# Altium project Smart_DCDC.PRJPCB
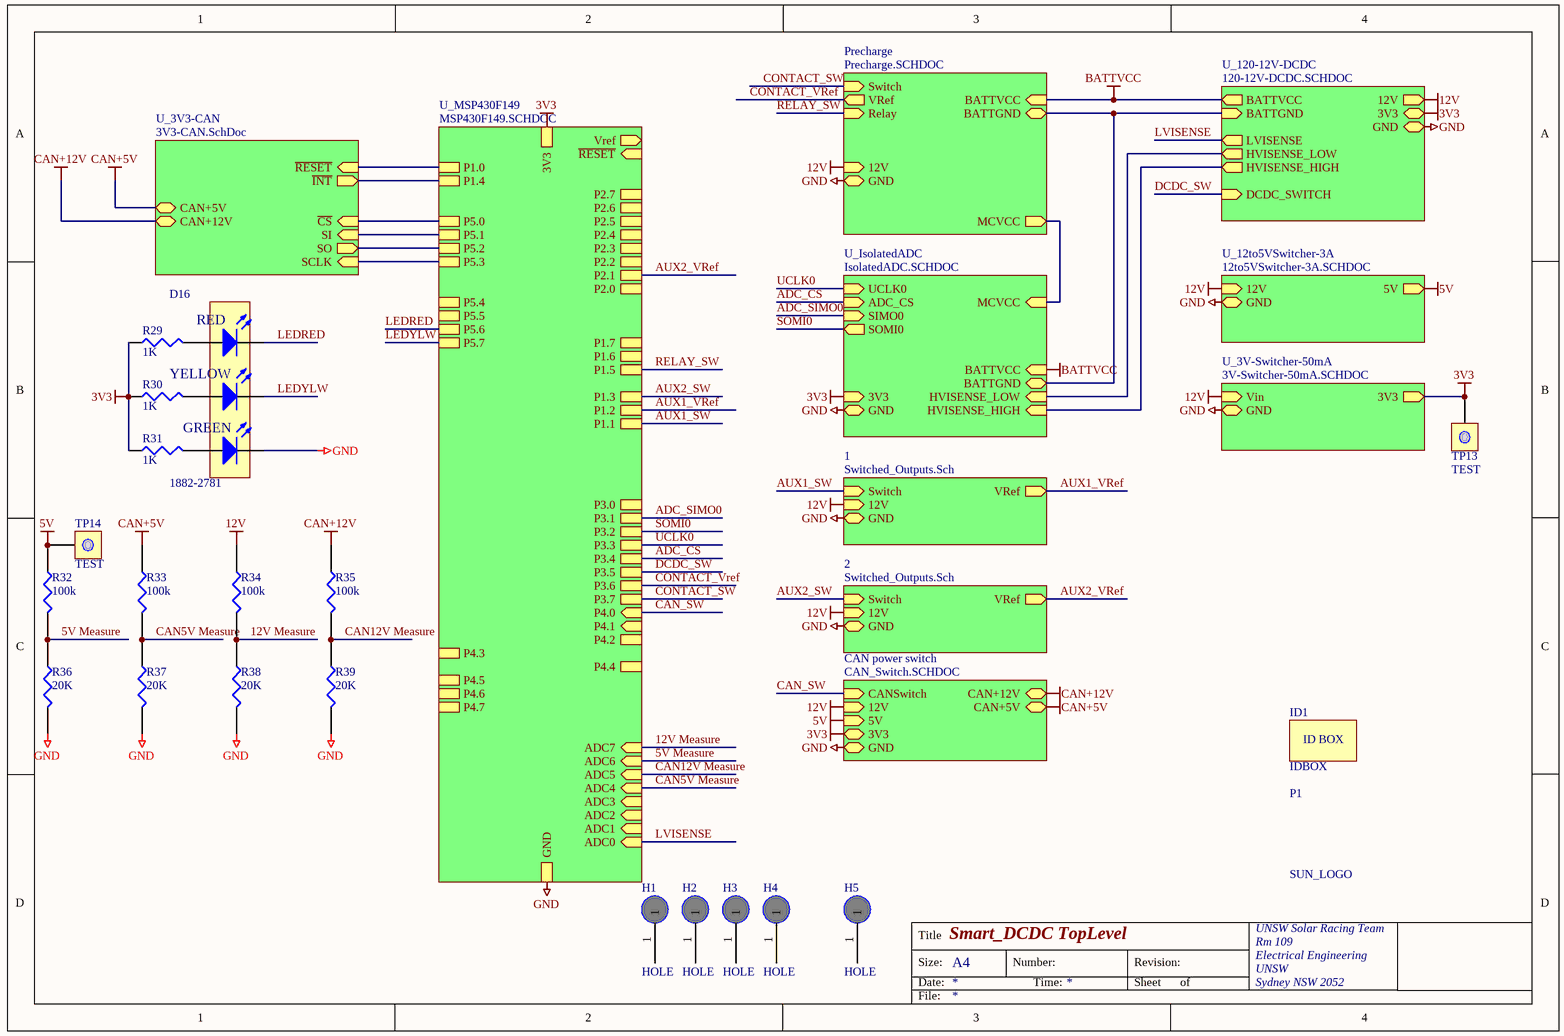
[diagram p0: TopLevel.SCHDOC]
9 sheets, 168 parts. Net scope: hierarchical (ports join the sheet entries above them; power ports are global).
Board files: Smart_DCDC_v5.PCBDOC, endpanel_highvoltage.PcbDoc, endpanel_lowvoltage.PcbDoc
Sheets:
  TopLevel.SCHDOC
    U_MSP430F149 = MSP430F149.SCHDOC
    U_120-12V-DCDC = 120-12V-DCDC.SCHDOC
    U_12to5VSwitcher-3A = 12to5VSwitcher-3A.SCHDOC
    U_3V3-CAN = 3V3-CAN.SchDoc
    U_3V-Switcher-50mA = 3V-Switcher-50mA.SCHDOC
    Precharge = Precharge.SCHDOC
    CAN power switch = CAN_Switch.SCHDOC
    U_IsolatedADC = IsolatedADC.SCHDOC

## Sheet TopLevel.SCHDOC: Smart_DCDC TopLevel
size A4; Organization: UNSW Solar Racing Team; Address3: UNSW; Address4: Sydney NSW 2052; Address2: Electrical Engineering; Address1: Rm 109

### Parts
D16  1882-2781  [LED_TRILEVEL]
H1  HOLE  [#6]
H2  HOLE  [#6]
H3  HOLE  [#6]
H4  HOLE  [#6]
H5  HOLE  [#6]
ID1  IDBOX  [IDBOX]
P1  SUN_LOGO  [SUNSWIFTLOGO]
R29  1K  [0603]
R30  1K  [0603]
R31  1K  [0603]
R32  100k  [1206]
R33  100k  [1206]
R34  100k  [1206]
R35  100k  [1206]
R36  20K  [1206]
R37  20K  [1206]
R38  20K  [1206]
R39  20K  [1206]
TP13  TEST  [TESTPOINT]
TP14  TEST  [TESTPOINT]

### Sub-sheets
1 = Switched_Outputs.Sch (file not in this document): Switch (in), VRef (out), 12V (in), GND (bidir)
2 = Switched_Outputs.Sch (file not in this document): Switch (in), VRef (out), 12V (in), GND (bidir)
CAN power switch = CAN_Switch.SCHDOC: 12V (in), CAN+12V (bidir), GND (bidir), CANSwitch (in), 5V (in), CAN+5V (bidir), 3V3
Precharge = Precharge.SCHDOC: BATTVCC (in), BATTGND (bidir), GND (bidir), 12V (in), Relay (in), Switch (in), VRef (out), MCVCC (out)
U_3V3-CAN = 3V3-CAN.SchDoc: SI (in), SO (out), ~{CS} (in), SCLK (in), ~{INT} (out), ~{RESET} (in), CAN+5V (bidir), CAN+12V (bidir)
U_3V-Switcher-50mA = 3V-Switcher-50mA.SCHDOC: GND (bidir), 3V3, Vin (in)
U_12to5VSwitcher-3A = 12to5VSwitcher-3A.SCHDOC: 12V (in), GND (bidir), 5V (out)
U_120-12V-DCDC = 120-12V-DCDC.SCHDOC: BATTVCC (out), BATTGND, 12V (out), GND (bidir), 3V3, LVISENSE (out), HVISENSE_LOW (out), HVISENSE_HIGH (out), DCDC_SWITCH (in)
U_IsolatedADC = IsolatedADC.SCHDOC: UCLK0 (in), ADC_CS (in), SIMO0 (in), SOMI0 (out), BATTGND, GND (bidir), BATTVCC (in), MCVCC (in), HVISENSE_LOW (in), HVISENSE_HIGH (in), 3V3 (in)
U_MSP430F149 = MSP430F149.SCHDOC: GND, 3V3, ADC0 (in), ADC1 (in), ADC2 (in), ADC3 (in), ADC4 (in), ADC5 (in), ADC6 (in), ADC7 (in), P1.0, P1.1, P1.2, P1.3, P1.4, P1.5, P1.6, P1.7, P2.0, P2.1, P2.2, P2.3, P2.4, P2.5, P2.6, P2.7, P3.0, P3.1, P3.2, P3.3, P3.4, Vref (out), ~{RESET} (in), P3.5, P3.6, P3.7, P4.0 (in), P4.1 (in), P4.2, P4.3, P4.4, P4.5, P4.6, P4.7, P5.0, P5.1, P5.2, P5.3, P5.4, P5.5, P5.6, P5.7

### Nets
3V3: R29.1 R30.1 R31.1 TP13.0(TP) ; sheet U_MSP430F149/3V3, sheet U_120-12V-DCDC/3V3, sheet U_3V-Switcher-50mA/3V3, sheet CAN power switch/3V3, sheet U_IsolatedADC/3V3
5V: R32.1 TP14.0(TP) ; sheet U_12to5VSwitcher-3A/5V, sheet CAN power switch/5V
12V: R34.1 ; sheet U_120-12V-DCDC/12V, sheet U_12to5VSwitcher-3A/12V, sheet U_3V-Switcher-50mA/Vin, sheet 1/12V, sheet 2/12V, sheet Precharge/12V, sheet CAN power switch/12V
BATTGND: sheet U_120-12V-DCDC/BATTGND, sheet Precharge/BATTGND, sheet U_IsolatedADC/BATTGND
BATTVCC: sheet U_120-12V-DCDC/BATTVCC, sheet Precharge/BATTVCC, sheet U_IsolatedADC/BATTVCC
CAN+5V: R33.1 ; sheet U_3V3-CAN/CAN+5V, sheet CAN power switch/CAN+5V
CAN+12V: R35.1 ; sheet U_3V3-CAN/CAN+12V, sheet CAN power switch/CAN+12V
GND: D16.1(K) R36.2 R37.2 R38.2 R39.2 ; sheet U_MSP430F149/GND, sheet U_120-12V-DCDC/GND, sheet U_12to5VSwitcher-3A/GND, sheet U_3V-Switcher-50mA/GND, sheet 1/GND, sheet 2/GND, sheet Precharge/GND, sheet CAN power switch/GND, sheet U_IsolatedADC/GND
5V Measure: R32.2 R36.1 ; sheet U_MSP430F149/ADC6
12V Measure: R34.2 R38.1 ; sheet U_MSP430F149/ADC7
ADC_CS: sheet U_MSP430F149/P3.4, sheet U_IsolatedADC/ADC_CS
ADC_SIMO0: sheet U_MSP430F149/P3.1, sheet U_IsolatedADC/SIMO0
AUX1_SW: sheet U_MSP430F149/P1.1, sheet 1/Switch
AUX1_VRef: sheet U_MSP430F149/P1.2, sheet 1/VRef
AUX2_SW: sheet U_MSP430F149/P1.3, sheet 2/Switch
AUX2_VRef: sheet U_MSP430F149/P2.1, sheet 2/VRef
CAN5V Measure: R33.2 R37.1 ; sheet U_MSP430F149/ADC4  [project net ADC4]
CAN12V Measure: R35.2 R39.1 ; sheet U_MSP430F149/ADC5  [project net ADC5]
CAN_SW: sheet U_MSP430F149/P4.0, sheet CAN power switch/CANSwitch
CONTACT_SW: sheet U_MSP430F149/P3.7, sheet Precharge/Switch
CONTACT_Vref: sheet U_MSP430F149/P3.6, sheet Precharge/VRef
DCDC_SW: sheet U_MSP430F149/P3.5, sheet U_120-12V-DCDC/DCDC_SWITCH
LEDRED: D16.3(K) ; sheet U_MSP430F149/P5.6
LEDYLW: D16.2(K) ; sheet U_MSP430F149/P5.7
LVISENSE: sheet U_MSP430F149/ADC0, sheet U_120-12V-DCDC/LVISENSE  [project net ADC0]
MCVCC: sheet Precharge/MCVCC, sheet U_IsolatedADC/MCVCC
P1.0: sheet U_MSP430F149/P1.0, sheet U_3V3-CAN/~{RESET}
P1.4: sheet U_MSP430F149/P1.4, sheet U_3V3-CAN/~{INT}
P5.0: sheet U_MSP430F149/P5.0, sheet U_3V3-CAN/~{CS}
P5.1: sheet U_MSP430F149/P5.1, sheet U_3V3-CAN/SI
P5.2: sheet U_MSP430F149/P5.2, sheet U_3V3-CAN/SO
P5.3: sheet U_MSP430F149/P5.3, sheet U_3V3-CAN/SCLK
RELAY_SW: sheet U_MSP430F149/P1.5, sheet Precharge/Relay  [project net P1.5]
SOMI0: sheet U_MSP430F149/P3.2, sheet U_IsolatedADC/SOMI0  [project net P3.2]
UCLK0: sheet U_MSP430F149/P3.3, sheet U_IsolatedADC/UCLK0  [project net P3.3]
NetC22_1: sheet U_120-12V-DCDC/HVISENSE_HIGH, sheet U_IsolatedADC/HVISENSE_HIGH
NetC22_2: sheet U_120-12V-DCDC/HVISENSE_LOW, sheet U_IsolatedADC/HVISENSE_LOW
NetD16_4: D16.4(A) R29.2
NetD16_5: D16.5(A) R30.2
NetD16_6: D16.6(A) R31.2

Not connected (* = marked no-connect by the designer): H1 1; H2 1; H3 1; H4 1; H5 1

### Notes on the sheet
- Title
- Size:
- Date:
- A4
- Number:
- Time:
- Revision:
- Sheet
- of
- File:
- (in symbol IDBOX) ID BOX
- (in symbol LED-TRILEVEL) RED; YELLOW; GREEN

### Library data of the parts
D16 = LED-TRILEVEL: Three level LED; Farnell: 1461596
H1-H5 = HOLE: Order#: NA; Supplier: NA; Price: NA
R29-R31 = RES1: Resistor; Order#: 9331697; Supplier: Farnell; Price: 0.05
R32-R39 = RES1: Price: 1.16; Digikey: -
  R32-R35: Farnell: 308-6422
  R36-R39: Farnell: 308-6252
TP13 TP14 = TEST: TEST POINT

## Sheet MSP430F149.SCHDOC
size A4; Organization: UNSW Solar Racing Team; Address3: UNSW; Address4: Sydney NSW 2052; Address2: Electrical Engineering; Address1: Rm 109
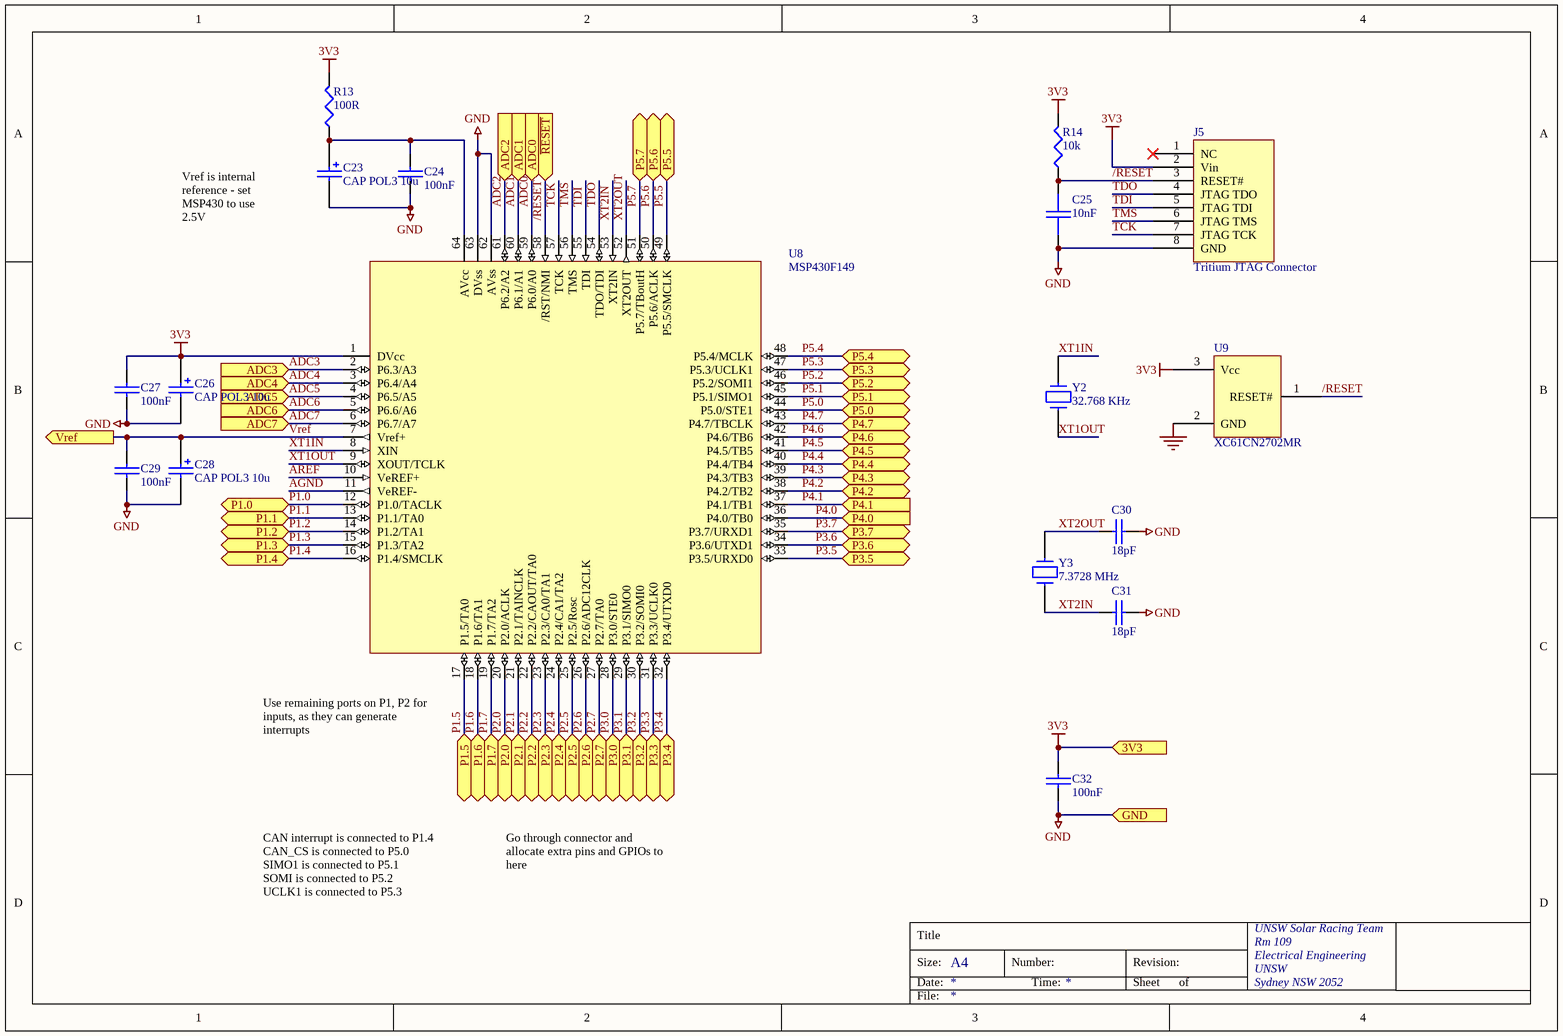
[diagram p1: MSP430F149.SCHDOC]

### Parts
C23  CAP POL3 10u  [MCCT-CASEA]
C24  100nF  [0603]
C25  10nF  [0603]
C26  CAP POL3 10u  [MCCT-CASEA]
C27  100nF  [0603]
C28  CAP POL3 10u  [MCCT-CASEA]
C29  100nF  [0603]
C30  18pF  [0603]
C31  18pF  [0603]
C32  100nF  [0603]
J5  Tritium JTAG Connector  [HDR2X5]
R13  100R  [0603]
R14  10k  [0603]
U8  MSP430F149  [QFP64]
U9  XC61CN2702MR  [SOT23-3]
Y2  32.768 KHz  [WATCHA]
Y3  7.3728 MHz  [HC49/4H]

### Ports
3V3, ADC0 (in), ADC1 (in), ADC2 (in), ADC3 (in), ADC4 (in), ADC5 (in), ADC6 (in), ADC7 (in), GND, P1.0, P1.1, P1.2, P1.3, P1.4, P1.5, P1.6, P1.7, P2.0, P2.1, P2.2, P2.3, P2.4, P2.5, P2.6, P2.7, P3.0, P3.1, P3.2, P3.3, P3.4, P3.5, P3.6, P3.7, P4.0 (in), P4.1 (in), P4.2, P4.3, P4.4, P4.5, P4.6, P4.7, P5.0, P5.1, P5.2, P5.3, P5.4, P5.5, P5.6, P5.7, Vref (out), ~{RESET} (in)

### Nets
3V3: C26.1 C27.1 C32.1 J5.2(Vin) R13.2 R14.2 U8.1(DVcc) U9.3(Vcc) ; port 3V3
GND: C23.2 C24.2 C25.2 C26.2 C27.2 C28.2 C29.2 C30.2 C31.2 C32.2 J5.8(GND) U8.62(AVss) U8.63(DVss) U9.2(GND) ; port GND
/RESET: C25.1 J5.3(RESET#) R14.1 U8.58(/RST/NMI) U9.1(RESET#) ; port ~{RESET}
ADC0: U8.59(P6.0/A0) ; port ADC0
ADC1: U8.60(P6.1/A1) ; port ADC1
ADC2: U8.61(P6.2/A2) ; port ADC2
ADC3: U8.2(P6.3/A3) ; port ADC3
ADC4: U8.3(P6.4/A4) ; port ADC4
ADC5: U8.4(P6.5/A5) ; port ADC5
ADC6: U8.5(P6.6/A6) ; port ADC6  [project net 5V Measure]
ADC7: U8.6(P6.7/A7) ; port ADC7  [project net 12V Measure]
AGND: U8.11(VeREF-)
AREF: U8.10(VeREF+)
P1.0: U8.12(P1.0/TACLK) ; port P1.0
P1.1: U8.13(P1.1/TA0) ; port P1.1  [project net AUX1_SW]
P1.2: U8.14(P1.2/TA1) ; port P1.2  [project net AUX1_VRef]
P1.3: U8.15(P1.3/TA2) ; port P1.3  [project net AUX2_SW]
P1.4: U8.16(P1.4/SMCLK) ; port P1.4
P1.5: U8.17(P1.5/TA0) ; port P1.5
P1.6: U8.18(P1.6/TA1) ; port P1.6
P1.7: U8.19(P1.7/TA2) ; port P1.7
P2.0: U8.20(P2.0/ACLK) ; port P2.0
P2.1: U8.21(P2.1/TAINCLK) ; port P2.1  [project net AUX2_VRef]
P2.2: U8.22(P2.2/CAOUT/TA0) ; port P2.2
P2.3: U8.23(P2.3/CA0/TA1) ; port P2.3
P2.4: U8.24(P2.4/CA1/TA2) ; port P2.4
P2.5: U8.25(P2.5/Rosc) ; port P2.5
P2.6: U8.26(P2.6/ADC12CLK) ; port P2.6
P2.7: U8.27(P2.7/TA0) ; port P2.7
P3.0: U8.28(P3.0/STE0) ; port P3.0
P3.1: U8.29(P3.1/SIMO0) ; port P3.1  [project net ADC_SIMO0]
P3.2: U8.30(P3.2/SOMI0) ; port P3.2
P3.3: U8.31(P3.3/UCLK0) ; port P3.3
P3.4: U8.32(P3.4/UTXD0) ; port P3.4  [project net ADC_CS]
P3.5: U8.33(P3.5/URXD0) ; port P3.5  [project net DCDC_SW]
P3.6: U8.34(P3.6/UTXD1) ; port P3.6  [project net CONTACT_Vref]
P3.7: U8.35(P3.7/URXD1) ; port P3.7  [project net CONTACT_SW]
P4.0: U8.36(P4.0/TB0) ; port P4.0  [project net CAN_SW]
P4.1: U8.37(P4.1/TB1) ; port P4.1
P4.2: U8.38(P4.2/TB2) ; port P4.2
P4.3: U8.39(P4.3/TB3) ; port P4.3
P4.4: U8.40(P4.4/TB4) ; port P4.4
P4.5: U8.41(P4.5/TB5) ; port P4.5
P4.6: U8.42(P4.6/TB6) ; port P4.6
P4.7: U8.43(P4.7/TBCLK) ; port P4.7
P5.0: U8.44(P5.0/STE1) ; port P5.0
P5.1: U8.45(P5.1/SIMO1) ; port P5.1
P5.2: U8.46(P5.2/SOMI1) ; port P5.2
P5.3: U8.47(P5.3/UCLK1) ; port P5.3
P5.4: U8.48(P5.4/MCLK) ; port P5.4
P5.5: U8.49(P5.5/SMCLK) ; port P5.5
P5.6: U8.50(P5.6/ACLK) ; port P5.6  [project net LEDRED]
P5.7: U8.51(P5.7/TBoutH) ; port P5.7  [project net LEDYLW]
TCK: J5.7(JTAG_TCK) U8.57(TCK)
TDI: J5.5(JTAG_TDI) U8.55(TDI)
TDO: J5.4(JTAG_TDO) U8.54(TDO/TDI)
TMS: J5.6(JTAG_TMS) U8.56(TMS)
Vref: C28.1 C29.1 U8.7(Vref+) ; port Vref
XT1IN: U8.8(XIN) Y2.2
XT1OUT: U8.9(XOUT/TCLK) Y2.1
XT2IN: C31.1 U8.53(XT2IN) Y3.1
XT2OUT: C30.1 U8.52(XT2OUT) Y3.2
NetC23_1: C23.1 C24.1 R13.1 U8.64(AVcc)

Not connected (* = marked no-connect by the designer): J5 1(NC)*

### Notes on the sheet
- Vref is internal reference - set MSP430 to use 2.5V
- (near U8) Use remaining ports on P1, P2 for inputs, as they can generate interrupts
- CAN interrupt is connected to P1.4
  CAN_CS is connected to P5.0
  SIMO1 is connected to P5.1
  SOMI is connected to P5.2
  UCLK1 is connected to P5.3
- Go through connector and allocate extra pins and GPIOs to here
- Title
- Size:
- Date:
- A4
- Number:
- Time:
- Revision:
- Sheet
- of
- File:

### Library data of the parts
C23 C26 C28 = CAP POL3: Polarized Capacitor (Surface Mount); Revision: July-2002: Re-released for DXP Platform.; Digikey: 478-3121-1-ND; DigikeyPrice: 0.41; Farnell: 1432264; FarnellPrice: 0.30
C24 C25 C27 C29-C32 = CAP: Capacitor
  C24 C27 C29 C32: Farnell: 753-567; Price: 0.30
  C25: Farnell: 722-236; Price: 0.11
  C30 C31: Farnell: 721-992; Price: 0.10
J5 = 430F_JTAG_TRITIUM: Tritium JTAG interface for MSP430; Extra parts: 672-520, 672-555; Farnell: 1022233; Price: 2.19
R13 R14 = RES1: Resistor; Price: 0.11
  R13: Farnell: 612-364
  R14: Farnell: 612-601
U8 = MSP430F14X: Farnell: NA
U9 = XC61F: SOT23 reset generator; Farnell: 3605449; FarnellPrice: 1.42; Digikey: -
Y2 Y3 = CRYSTAL
  Y2: Farnell: 9509682; FarnellPrice: 2.14; Digikey: 300-8301-ND; DigikeyPrice: 0.28
  Y3: Farnell: 7940385; FarnellPrice: 0.835; Digikey: X1056-ND; DigikeyPrice: 0.58

## Sheet 120-12V-DCDC.SCHDOC: 120V - 12/15V DCDC Converter
size A4; Organization: UNSW Solar Racing Team; Address3: UNSW; Address4: Sydney NSW 2052; SheetNumber: 2; SheetTotal: 4; Address2: Electrical Engineering; Address1: Rm 109
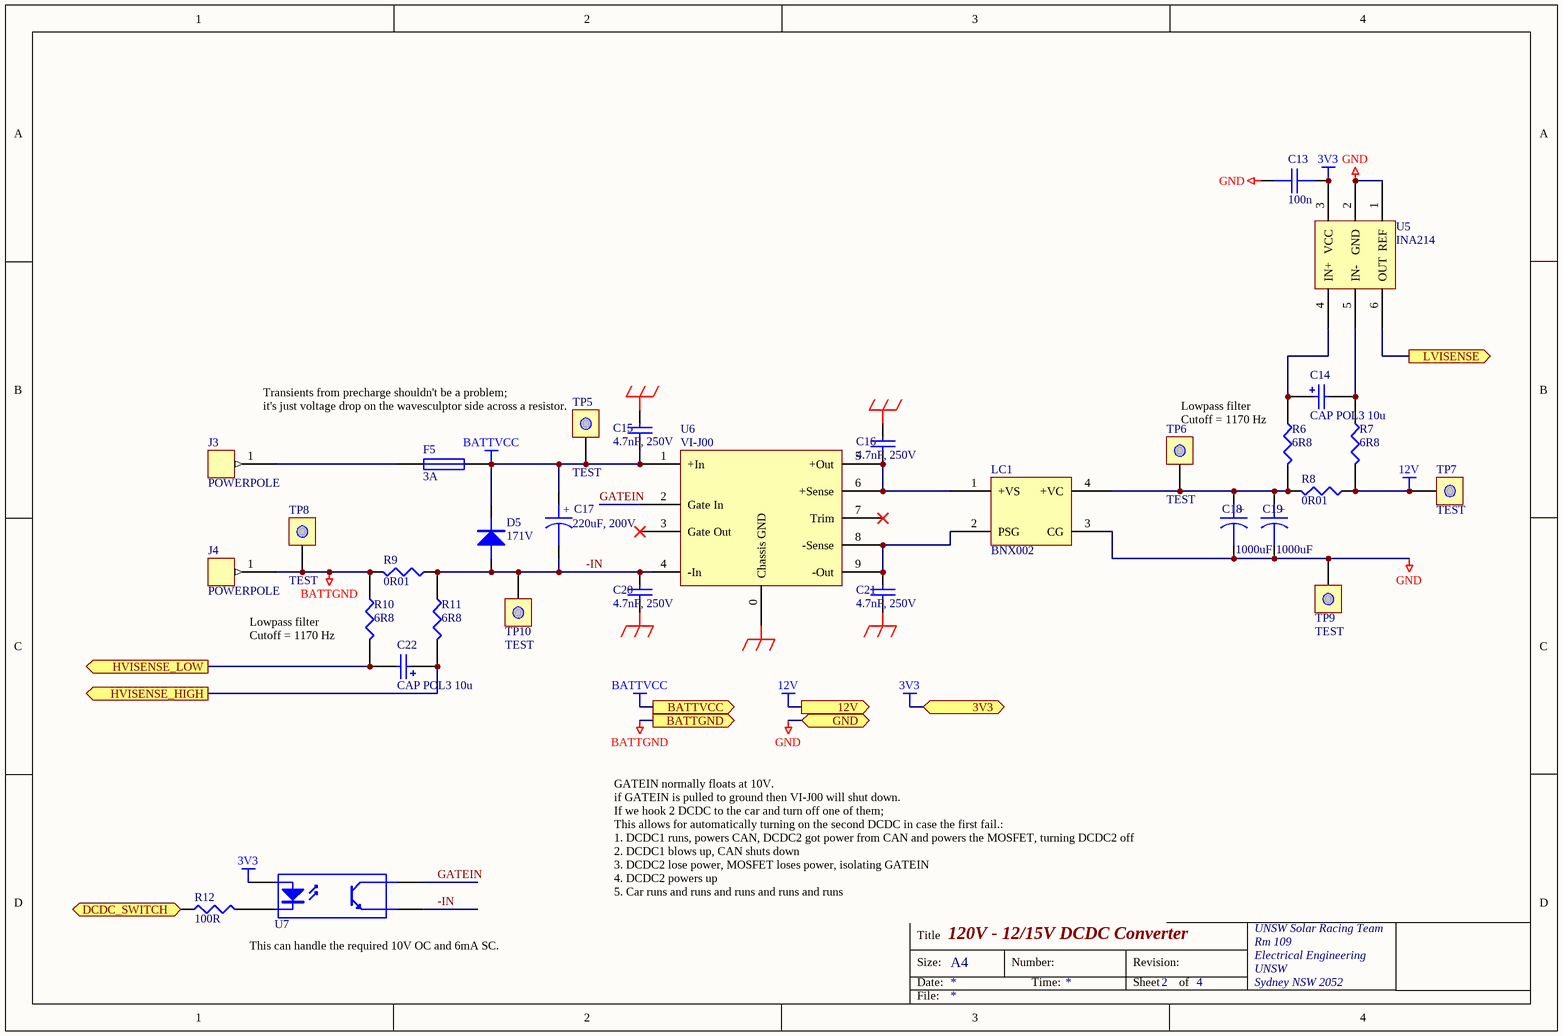
[diagram p2: 120-12V-DCDC.SCHDOC]

### Parts
C13  100n  [0603]
C14  CAP POL3 10u  [MCCT-CASEA]
C15  4.7nF, 250V  [POLYESTER-5]
C16  4.7nF, 250V  [POLYESTER-5]
C17  220uF, 200V  [ELECTROLYTIC-10-20]
C18  1000uF  [ELECTROLYTIC-5-10]
C19  1000uF  [ELECTROLYTIC-5-10]
C20  4.7nF, 250V  [POLYESTER-5]
C21  4.7nF, 250V  [POLYESTER-5]
C22  CAP POL3 10u  [MCCT-CASEA]
D5  171V  [DIODE-D1.2mm]
F5  3A  [FUSE-BAYONET-RA]
J3  POWERPOLE  [POWERPOLE25A]
J4  POWERPOLE  [POWERPOLE25A]
LC1  BNX002  [BNX002]
R6  6R8  [0603]
R7  6R8  [0603]
R8  0R01  [CRA2512]
R9  0R01  [CRA2512]
R10  6R8  [0603]
R11  6R8  [0603]
R12  100R  [0603]
TP5  TEST  [TESTPOINT]
TP6  TEST  [TESTPOINT]
TP7  TEST  [TESTPOINT]
TP8  TEST  [TESTPOINT]
TP9  TEST  [TESTPOINT]
TP10  TEST  [TESTPOINT]
U5  INA214  [SC70-6]
U6  VI-J00  [VI-J00]
U7  PC3H7J00000F  [PC3H7]  (value not drawn)

### Ports
3V3, 12V (out), BATTGND, BATTVCC (out), DCDC_SWITCH (in), GND (bidir), HVISENSE_HIGH (out), HVISENSE_LOW (out), LVISENSE (out)

### Nets
3V3: C13.2 U5.3(VCC) U7.1(A) ; port 3V3
12V: R7.2 R8.1 TP7.0(TP) ; port 12V
BATTGND: J4.1 R9.2 R10.1 TP8.0(TP) ; port BATTGND
BATTVCC: C15.1 C17.1 D5.K F5.1 TP5.0(TP) U6.1(+In) ; port BATTVCC
CGND: C15.2 C16.2 C20.1 C21.1 U6.0(Chassis_GND)
GND: C13.1 C18.2 C19.2 LC1.3(CG) TP9.0(TP) U5.1(REF) U5.2(GND) ; port GND
-IN: C17.2 C20.2 D5.A R9.1 R11.1 TP10.0(TP) U6.4(-In) U7.3(E)
ADC0: U5.6(OUT) ; port LVISENSE
DCDC_SW: R12.1 ; port DCDC_SWITCH
GATEIN: U6.2(Gate_In) U7.4(C)
NetC14_1: C14.1 R6.1 U5.4(IN+)
NetC14_2: C14.2 R7.1 U5.5(IN-)
NetC16_1: C16.1 LC1.1(+VS) U6.5(+Out) U6.6(+Sense)
NetC18_1: C18.1 C19.1 LC1.4(+VC) R6.2 R8.2 TP6.0(TP)
NetC21_2: C21.2 LC1.2(PSG) U6.8(-Sense) U6.9(-Out)
NetC22_1: C22.1 R11.2 ; port HVISENSE_HIGH
NetC22_2: C22.2 R10.2 ; port HVISENSE_LOW
NetF5_2: F5.2 J3.1
NetR12_2: R12.2 U7.2(K)

Not connected (* = marked no-connect by the designer): U6 3(Gate_Out)* 7(Trim)*

### Notes on the sheet
- (near TP5) Transients from precharge shouldn't be a problem;
  it's just voltage drop on the wavesculptor side across a resistor.
- Lowpass filter
  Cutoff = 1170 Hz
- (near R10) Lowpass filter
  Cutoff = 1170 Hz
- GATEIN normally floats at 10V.
  if GATEIN is pulled to ground then VI-J00 will shut down.
  If we hook 2 DCDC to the car and turn off one of them;
  This allows for automatically turning on the second DCDC in case the first fail.:
  1. DCDC1 runs, powers CAN, DCDC2 got power from CAN and powers the MOSFET, turning DCDC2 off
  2. DCDC1 blows up, CAN shuts down
  3. DCDC2 lose power, MOSFET loses power, isolating GATEIN
  4. DCDC2 powers up
  5. Car runs and runs and runs and runs and runs
- This can handle the required 10V OC and 6mA SC.
- Title
- Size:
- Date:
- A4
- Number:
- Time:
- Revision:
- Sheet
- of
- File:
- (in symbol CAPACITOR POL) +

### Library data of the parts
C13 C15 C16 C20 C21 = CAP: Capacitor
  C13: Price: 0.30
  C15 C16 C20 C21: Price: 0.18; Farnell: 1166076; Digikey: 3005PH-ND; DigikeyPrice: 0.124
C14 C22 = CAP POL3: Polarized Capacitor (Surface Mount); Revision: July-2002: Re-released for DXP Platform.; Digikey: 478-3121-1-ND; DigikeyPrice: 0.41; Farnell: 1432264; FarnellPrice: 0.30
C17-C19 = CAPACITOR POL: Capacitor
  C17: FarnellPrice: 2.91; Farnell: 1040995; Digikey: 493-2504-ND; DigikeyPrice: 2.05
  C18 C19: Price: 1.36; Farnell: 9451226
D5 = DIODE: Order#: 1017610; Supplier: Farnell; Price: ?
F5 = FUSE1: Fuse; Price: 5.43; Farnell: 149-920; Digikey: -
J3 = CON1: RS: 534-985 + 534-963; Farnell: -; Digikey: -
J4 = CON1: RS: 534-979 + 534-963; Farnell: -; Digikey: -
LC1 = BNX002: 10A Switchmode Supply Output Filter; Farnell: 9526943; FarnellPrice: 15.0; Digikey: BNX002-01; DigikeyPrice: 11.90
R6 R7 R10 R11 = RES1
R8 R9 = CRA2512: Current Sense Resistor; Farnell: 1435947; Price: 0.736
  R9: Digikey: CRA2512-FZ-R010ELFCT-ND; DigikeyPrice: 0.49
R12 = RES1: Resistor
TP5-TP10 = TEST: TEST POINT
U5 = INA214: Current Sensor; Farnell: 1606447; Digikey: 296-23422-1-ND
U6 = VI-J00: VI-J00 Switch Mode DC-DC Converter
U7 = PC3H7J00000F: Opto-coupler; Farnell: 9707603; FarnellPrice: 0.6; Digikey: 425-2116-1-ND; DigikeyPrice: 0.45

## Sheet 12to5VSwitcher-3A.SCHDOC
size A4; Organization: UNSW Solar Racing Team; Address3: UNSW; Address4: Sydney NSW 2052; Address2: Electrical Engineering; Address1: Rm 109
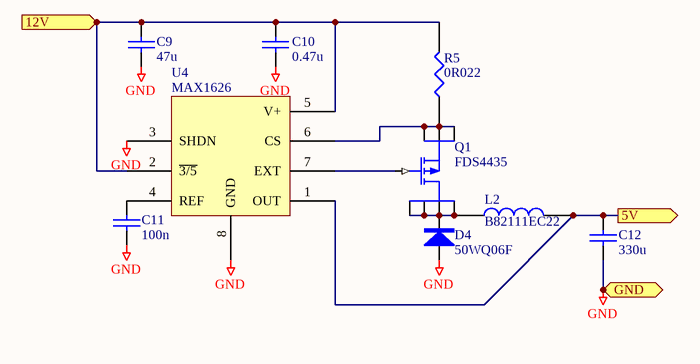
[diagram p3: 12to5VSwitcher-3A.SCHDOC]

### Parts
C9  47u  [KEMET_CASED]
C10  0.47u  [1206]
C11  100n  [0603]
C12  330u  [KEMET_CASED]
D4  50WQ06F  [DPAK]
L2  B82111EC22  [PCH-45]
Q1  FDS4435  [SO8]
R5  0R022  [2512]
U4  MAX1626  [SO8]

### Ports
5V (out), 12V (in), GND (bidir)

### Nets
5V: C12.1 L2.2 U4.1(OUT) ; port 5V
12V: C9.1 C10.1 R5.2 U4.2(~{3/5}) U4.5(V+) ; port 12V
GND: C9.2 C10.2 C11.2 C12.2 D4.1(A) U4.3(SHDN) U4.8(GND) ; port GND
NetC11_1: C11.1 U4.4(REF)
NetD4_2: D4.2(K) L2.1 Q1.5(D) Q1.6(D) Q1.7(D) Q1.8(D)
NetQ1_1: Q1.1(S) Q1.2(S) Q1.3(S) R5.1 U4.6(CS)
NetQ1_4: Q1.4(G) U4.7(EXT)

### Notes on the sheet
- Title
- Size:
- Date:
- A4
- Number:
- Time:
- Revision:
- Sheet
- of
- File:

### Library data of the parts
C9-C12 = CAP: Capacitor
  C9: Farnell: 1601655; Price: 1.29; Digikey: 495-1544-1-ND; DigikeyPrice: 0.87
  C10: FarnellPrice: 0.668; OldFarnell: 757-688; Farnell: 4900388
  C11: Farnell: have; Price: 0
  C12: Farnell: 1183405; FarnellPrice: 2.60; Digikey: 399-3884-1-ND; DigikeyPrice: 2.1
D4 = 50WQ06F: Diode; Farnell: 9101314; Price: 2.99
L2 = INDUCTOR: Digikey: 608671; DigikeyPrice: 1.24
Q1 = SI4425DY: FDS4435P Channel Mosfet; Farnell: 9846204; Price: 2.99; Digikey: FDS4435BZCT-ND; DigikeyPrice: 0.8
R5 = RES1: DigikeyPrice: 2.805; Digikey: RL32T.022GCT-ND
U4 = MAX1626: Farnell: 9725342; FarnellPrice: 9.09; Digikey: MAX1626ESA+-ND; DigikeyPrice: 4.61

## Sheet 3V3-CAN.SchDoc
size A4; Organization: UNSW Solar Racing Team; Address3: UNSW; Address4: Sydney NSW 2052; Address2: Electrical Engineering; Address1: Rm 109
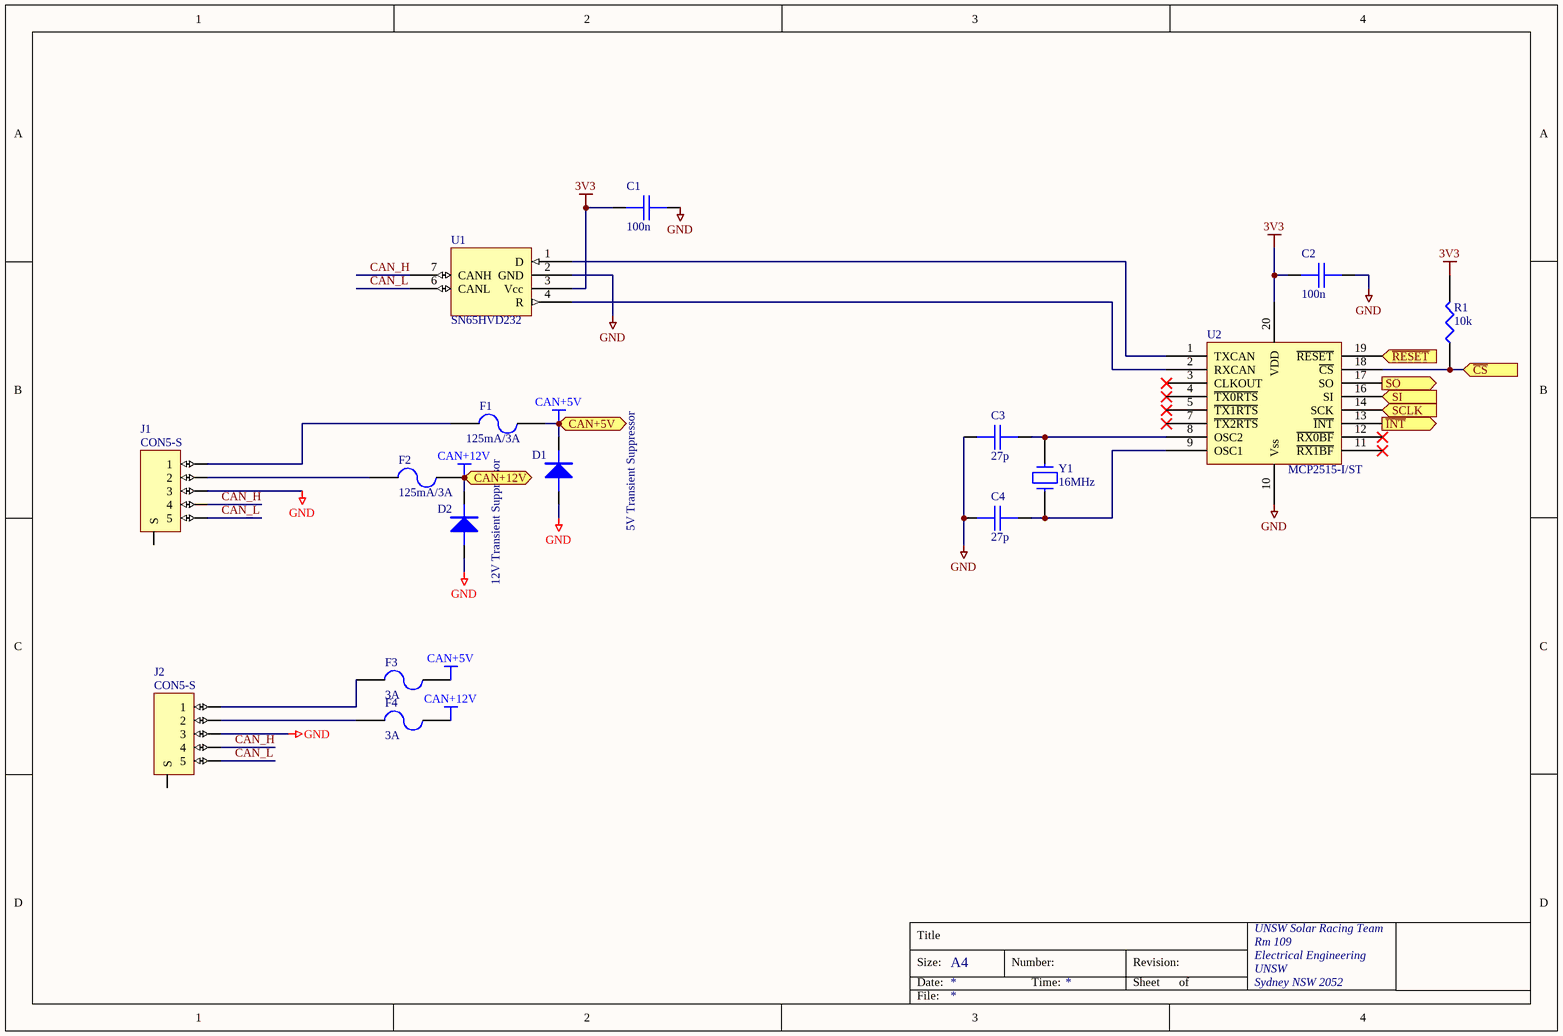
[diagram p4: 3V3-CAN.SchDoc]

### Parts
C1  100n  [0603]
C2  100n  [0603]
C3  27p  [0603]
C4  27p  [0603]
D1  5V Transient Suppressor  [SMA]
D2  12V Transient Suppressor  [SMA]
F1  125mA/3A  [LITTELFUSE-154]
F2  125mA/3A  [LITTELFUSE-154]
F3  3A  [LITTELFUSE-154]
F4  3A  [LITTELFUSE-154]
J1  CON5-S  [TRIAD5F]
J2  CON5-S  [TRIAD5F]
R1  10k  [0603]
U1  SN65HVD232  [SO8]
U2  MCP2515-I/ST  [TSSOP20]
Y1  16MHz  [HC49/4H]

### Ports
CAN+5V (bidir), CAN+12V (bidir), SCLK (in), SI (in), SO (out), ~{CS} (in), ~{INT} (out), ~{RESET} (in)

### Nets
3V3: C1.2 C2.1 R1.2 U1.3(Vcc) U2.20(VDD)
CAN+5V: D1.K F1.2 F3.2 ; port CAN+5V
CAN+12V: D2.K F2.2 F4.2 ; port CAN+12V
GND: C1.1 C2.2 C3.1 C4.1 D1.A D2.A J1.3 J2.3 U1.2(GND) U2.10(Vss)
CAN_H: J1.4 J2.4 U1.7(CANH)
CAN_L: J1.5 J2.5 U1.6(CANL)
P1.0: U2.19(~{RESET}) ; port ~{RESET}
P1.4: U2.13(~{INT}) ; port ~{INT}
P5.0: R1.1 U2.18(~{CS}) ; port ~{CS}
P5.1: U2.16(SI) ; port SI
P5.2: U2.17(SO) ; port SO
P5.3: U2.14(SCK) ; port SCLK
NetC3_2: C3.2 U2.8(OSC2) Y1.1
NetC4_2: C4.2 U2.9(OSC1) Y1.2
NetF1_1: F1.1 J1.1
NetF2_1: F2.1 J1.2
NetF3_1: F3.1 J2.1
NetF4_1: F4.1 J2.2
NetU1_1: U1.1(D) U2.1(TXCAN)
NetU1_4: U1.4(R) U2.2(RXCAN)

Not connected (* = marked no-connect by the designer): J1 0(S); J2 0(S); U2 3(CLKOUT)* 4(~{TX0RTS})* 5(~{TX1RTS})* 7(~{TX2RTS})* 11(~{RX1BF})* 12(~{RX0BF})*

### Notes on the sheet
- Title
- Size:
- Date:
- A4
- Number:
- Time:
- Revision:
- Sheet
- of
- File:

### Library data of the parts
C1 = CAP: Capacitor; something: 0.31; Note: Purchase a reel.; Farnell: 753-567; Price: 0.30
C2 = CAP: Capacitor; something: 0.31; note: Purchase a reel.; Farnell: 753-567; Price: 0.30
C3 C4 = CAP: Capacitor; Farnell - 15pF: 721-980; Farnell: 722-017; Price: 0.30
D1 D2 = DIODE
  D1: Farnell: 1467627; FarnellPrice: 0.538; Digikey: 497-2999-1-ND; DigikeyPrice: 0.60
  D2: Farnell: 9802754; FarnellPrice: 1.20; Digikey: 497-6503-1-ND; DigikeyPrice: 0.56
F1-F4 = FUSE2: Fuse; Farnell: 154-375T (Holder + 125mA fuse) AND 0454 003 (3A Fuse); Price: 4.00
J1 J2 = CON5-S: Connector, 2 pin, with shield @ S; Farnell: 131-040; Price: 16.79
R1 = RES1: Farnell: 612-601; Price: 0.11
U1 = SN65HVD232: 3.3V CAN Transciever; Part Field 2: 5.00; Part Field 3: www.ti.com - Texas Instruments; Farnell: NA
U2 = MCP2515X/ST: MCP2510 CAN Controller; Farnell: 1196851; FarnellPrice: 4.78; Digikey: MCP2515-I/ST-ND; DigikeyPrice: 3.28
Y1 = CRYSTAL: Farnell: 9713700; Price: 2.31; Digikey: X1071-ND; DigikeyPrice: 0.58

## Sheet 3V-Switcher-50mA.SCHDOC
size A4; Organization: UNSW Solar Racing Team; Address3: UNSW; Address4: Sydney NSW 2052; Address2: Electrical Engineering; Address1: Rm 109
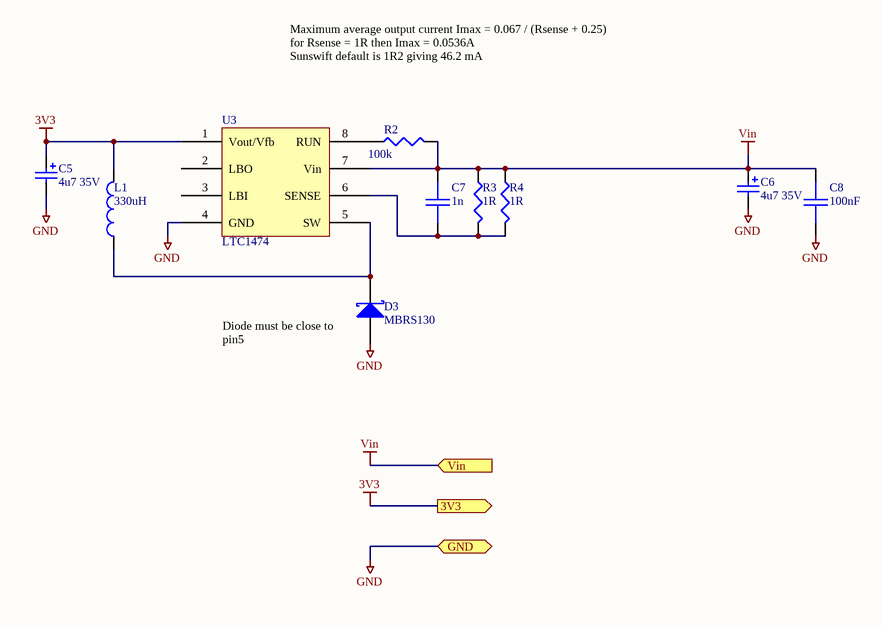
[diagram p5: 3V-Switcher-50mA.SCHDOC]

### Parts
C5  4u7 35V  [MCCT-CASEC]
C6  4u7 35V  [MCCT-CASEC]
C7  1n  [0603]
C8  100nF  [0603]
D3  MBRS130  [SMB]
L1  330uH  [2220]
R2  100k  [0603]
R3  1R  [0603]
R4  1R  [0603]
U3  LTC1474  [TSOP8]

### Ports
3V3, GND (bidir), Vin (in)

### Nets
3V3: C5.1 L1.2 U3.1(Vout/Vfb) ; port 3V3
GND: C5.2 C6.2 C8.2 D3.A U3.4(GND) ; port GND
Vin: C6.1 C7.1 C8.1 R2.2 R3.1 R4.1 U3.7(Vin) ; port Vin  [project net 12V]
NetC7_2: C7.2 R3.2 R4.2 U3.6(SENSE)
NetD3_K: D3.K L1.1 U3.5(SW)
NetR2_1: R2.1 U3.8(RUN)

Not connected (* = marked no-connect by the designer): U3 2(LBO) 3(LBI)

### Notes on the sheet
- Maximum average output current Imax = 0.067 / (Rsense + 0.25)
  for Rsense = 1R then Imax = 0.0536A
  Sunswift default is 1R2 giving 46.2 mA
- (near D3) Diode must be close to pin5
- Title
- Size:
- Date:
- A4
- Number:
- Time:
- Revision:
- Sheet
- of
- File:

### Library data of the parts
C5 C6 = Cap Pol3: Polarized Capacitor (Surface Mount); Value: 4.7uF; Revision: July-2002: Re-released for DXP Platform.; Farnell: 1565796; Price: 1.5; Digikey: 478-3106-1-ND; DigikeyPrice: 1.13
C7 = CAP: Capacitor; Value: 1nF; Revision: July-2002: Re-released for DXP Platform.; Farnell: 317-202; Price: 0.12
C8 = CAP: Capacitor; Value: 0.1uF; Revision: July-2002: Re-released for DXP Platform.; Farnell: 753-567; Price: 0.13
D3 = D SCHOTTKY: Schottky Diode; Revision: July-2002: Re-released for DXP Platform.; Farnell: 9556931; Price: 0.43; Digikey: MBRS130LT3GOSCT-ND; DigikeyPrice: 0.311
L1 = Inductor: Revision: July-2002: Re-released for DXP Platform.; Value: 330uH; Farnell: 1644442; FarnellPrice: 4.51; Digikey: 495-1762-1-ND; DigikeyPrice: 0.64
R2-R4 = RES1: Resistor
  R2: Value: 100k; Farnell: 9331719; Price: 0.05
  R3 R4: Revision: July-2002: Re-released for DXP Platform.; Value: 1R; Farnell: 9238131; Price: 0.09
U3 = LTC1474: Step-down converter; Farnell: 1273868; Price: 10.00; Digikey: LTC1474CS8-3.3#PBF-ND; DigikeyPrice: 6.88

## Sheet Precharge.SCHDOC
size A4; Organization: UNSW Solar Racing Team; Address3: UNSW; Address4: Sydney NSW 2052; Address2: Electrical Engineering; Address1: Rm 109
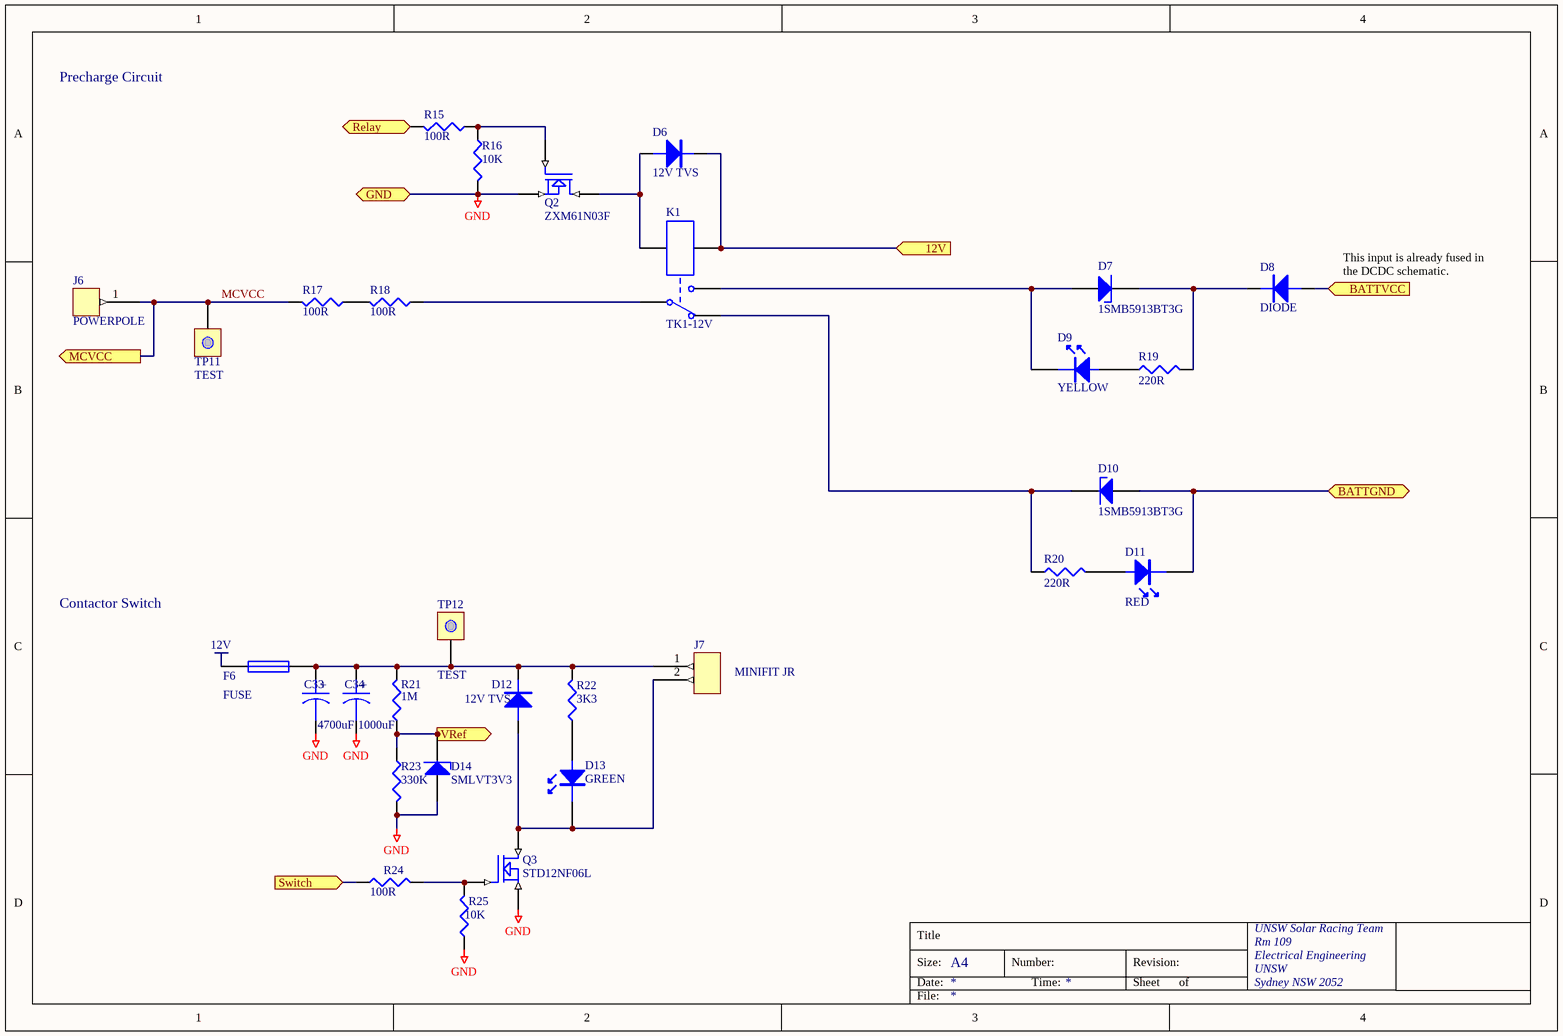
[diagram p6: Precharge.SCHDOC]

### Parts
C33  4700uF  [ELECTROLYTIC-10-20]
C34  1000uF  [ELECTROLYTIC-5-10]
D6  12V TVS  [SMA]
D7  1SMB5913BT3G  [SMB]
D8  DIODE  [DIODE-D1.2mm]
D9  YELLOW  [LED-RA]
D10  1SMB5913BT3G  [SMB]
D11  RED  [LED-RA]
D12  12V TVS  [SMA]
D13  GREEN  [LED-RA]
D14  SMLVT3V3  [SMB]
F6  FUSE  [LITTELFUSE-154]
J6  POWERPOLE  [POWERPOLE25A]
J7  MINIFIT JR  [MINIFITJR-2]
K1  TK1-12V  [TK1-12V]
Q2  ZXM61N03F  [SOT23-3]
Q3  STD12NF06L  [DPAK_N-MOSFET]
R15  100R  [0603]
R16  10K  [0603]
R17  100R  [LTO100]
R18  100R  [LTO100]
R19  220R  [0805]
R20  220R  [0805]
R21  1M  [0603]
R22  3K3  [0603]
R23  330K  [0603]
R24  100R  [0603]
R25  10K  [0603]
TP11  TEST  [TESTPOINT]
TP12  TEST  [TESTPOINT]

### Ports
12V (in), BATTGND (bidir), BATTVCC (in), GND (bidir), MCVCC (out), Relay (in), Switch (in), VRef (out)

### Nets
12V: D6.K F6.1 K1.1 ; port 12V
BATTGND: D10.A D11.K ; port BATTGND
BATTVCC: D8.A ; port BATTVCC
GND: C33.2 C34.2 D14.A Q2.2(S) Q3.3(S) R16.2 R23.2 R25.1 ; port GND
CONTACT_SW: R24.1 ; port Switch
CONTACT_Vref: D14.K R21.1 R23.1 ; port VRef
MCVCC: J6.1 R17.2 TP11.0(TP) ; port MCVCC
P1.5: R15.2 ; port Relay
NetC33_1: C33.1 C34.1 D12.K F6.2 J7.1 R21.2 R22.2 TP12.0(TP)
NetD6_A: D6.A K1.3 Q2.3(D)
NetD7_A: D7.A D9.K K1.6
NetD7_K: D7.K D8.K R19.2
NetD9_A: D9.A R19.1
NetD10_K: D10.K K1.4 R20.1
NetD11_A: D11.A R20.2
NetD12_A: D12.A D13.K J7.2 Q3.2(D)
NetD13_A: D13.A R22.1
NetK1_5: K1.5 R18.1
NetQ2_1: Q2.1(G) R15.1 R16.1
NetQ3_1: Q3.1(G) R24.2 R25.2
NetR17_1: R17.1 R18.2

### Notes on the sheet
- Precharge Circuit
- (near D8) This input is already fused in the DCDC schematic.
- Contactor Switch
- Title
- Size:
- Date:
- A4
- Number:
- Time:
- Revision:
- Sheet
- of
- File:
- (in symbol CAPACITOR POL) +

### Library data of the parts
C33 C34 = CAPACITOR POL: Capacitor
  C33: Digikey: 493-1089-ND; DigikeyPrice: 1.51
  C34: Price: 1.36; Farnell: 9451226
D6 D12 = DIODE: Farnell: 9802754; FarnellPrice: 1.20; Digikey: 497-6503-1-ND; DigikeyPrice: 0.56
D7 D10 = ZENER1: Zener Diode; Order#: 1431155; Supplier: Farnell; Price: 0.35
D9 D11 D13 = LED: Price: 0.81
  D9: Farnell: 1003378
  D11: Farnell: 1003377
  D13: Farnell: 1003381
D14 = ZENER1: TVS; Farnell: 9802886; Price: 1.10; Digikey: 497-2496-1-ND; DigikeyPrice: 0.72
J6 = CON1: RS: 459-222 + 534-963; Farnell: -; Digikey: -
J7 = CON2: Farnell: 1012166; FarnellPrice: 1.22; Digikey: WM3900-ND; DigikeyPrice: 0.99
K1 = TK1-12V: SPCO 12V 2A Relay; Farnell: 1380961; FarnellPrice: 7.07; Digikey: 255-1029-5-ND; DigikeyPrice: 4.7
Q2 = ZXM61N02F: 1.7A, 20V N-Channel Enhancement mode FET; Farnell: 9525289; Price: 0.73; Digikey: ZXM61N03FCT-ND; DigikeyPrice: 0.72
Q3 = STD12NF06L: N-type MOSFET; Farnell: 9946373
R15 R21-R24 = RES1
  R15: Farnell: 911-112; Price: 0.119
  R21: Farnell: 9330410; Price: 0.06
  R22: Farnell: 1632396; Price: 0.06
  R23: Farnell: 9330836; Price: 0.06
  R24: Farnell: 9330364; Price: 0.06
R16-R18 R25 = RES1: Resistor
  R16 R25: Farnell: 9330399; Price: 0.06
  R17 R18: Farnell: 9567330; Digikey: LT100J-100-ND; DigikeyPrice: 8.09; FarnellPrice: 22.4
R19 R20 = RES1: Resistor; Order#: 1469899; Supplier: Farnell; Price: 0.1
TP11 TP12 = TEST: TEST POINT
D8 = DIODE: Farnell: 9556133; FarnellPrice: 0.18
F6 = FUSE: Farnell: 9943609; Price: 7.78; Digikey: -

## Sheet CAN_Switch.SCHDOC
size A4; Organization: UNSW Solar Racing Team; Address3: UNSW; Address4: Sydney NSW 2052; Address2: Electrical Engineering; Address1: Rm 109
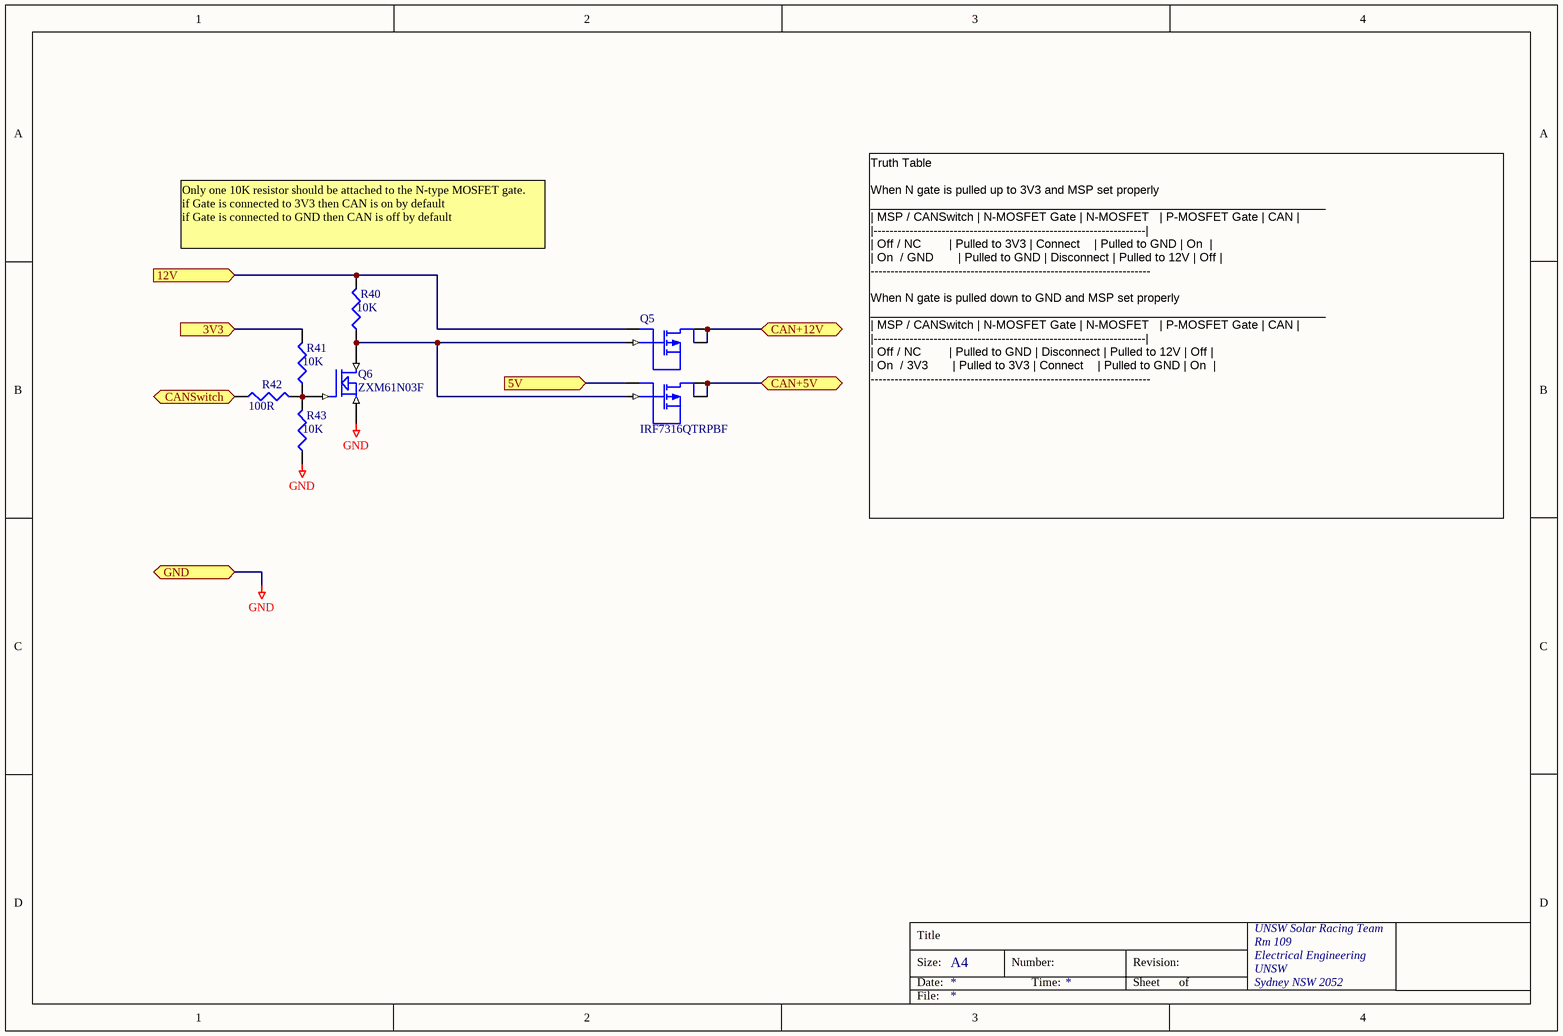
[diagram p7: CAN_Switch.SCHDOC]

### Parts
Q5  IRF7316QTRPBF  [SO8]
Q6  ZXM61N03F  [SOT23-3]
R40  10K  [0603]
R41  10K  [0603]
R42  100R  [0603]
R43  10K  [0603]

### Ports
3V3, 5V (in), 12V (in), CAN+5V (bidir), CAN+12V (bidir), CANSwitch (in), GND (bidir)

### Nets
3V3: R41.2 ; port 3V3
5V: Q5.3(S2) ; port 5V
12V: Q5.1(S1) R40.2 ; port 12V
CAN+5V: Q5.5(D2) Q5.6(D2) ; port CAN+5V
CAN+12V: Q5.7(D1) Q5.8(D1) ; port CAN+12V
GND: Q6.2(S) R43.1 ; port GND
CAN_SW: R42.1 ; port CANSwitch
NetQ5_2: Q5.2(G1) Q5.4(G2) Q6.3(D) R40.1
NetQ6_1: Q6.1(G) R41.1 R42.2 R43.2

### Notes on the sheet
- (near R40) Only one 10K resistor should be attached to the N-type MOSFET gate.
  if Gate is connected to 3V3 then CAN is on by default
  if Gate is connected to GND then CAN is off by default
- Truth Table
  When N gate is pulled up to 3V3 and MSP set properly
  ______________________________________________________________________
  | MSP / CANSwitch | N-MOSFET Gate | N-MOSFET   | P-MOSFET Gate | CAN |
  |--------------------------------------------------------------------|
  | Off / NC        | Pulled to 3V3 | Connect    | Pulled to GND | On  |
  | On  / GND       | Pulled to GND | Disconnect | Pulled to 12V | Off |
  ----------------------------------------------------------------------
  When N gate is pulled down to GND and MSP set properly
  ______________________________________________________________________
  | MSP / CANSwitch | N-MOSFET Gate | N-MOSFET   | P-MOSFET Gate | CAN |
  |--------------------------------------------------------------------|
  | Off / NC        | Pulled to GND | Disconnect | Pulled to 12V | Off |
  | On  / 3V3       | Pulled to 3V3 | Connect    | Pulled to GND | On  |
  ----------------------------------------------------------------------
- Title
- Size:
- Date:
- A4
- Number:
- Time:
- Revision:
- Sheet
- of
- File:

### Library data of the parts
Q5 = IRF7316QTRPBF: Dual P-type MOSFET IC; Farnell: 1531284; FarnellPrice: 1.47; Digikey: IRF7316QTRPBFCT-ND; DigikeyPrice: 1.8
Q6 = ZXM61N02F: 1.7A, 20V N-Channel Enhancement mode FET; Farnell: 9525289; Price: 0.73; Digikey: ZXM61N03FCT-ND; DigikeyPrice: 0.72
R40 R41 R43 = RES1: Resistor; Farnell: 9330399; Price: 0.06
R42 = RES1: Farnell: 9330364; Price: 0.06

## Sheet IsolatedADC.SCHDOC
size A4; Organization: UNSW Solar Racing Team; Address3: UNSW; Address4: Sydney NSW 2052; Address2: Electrical Engineering; Address1: Rm 109
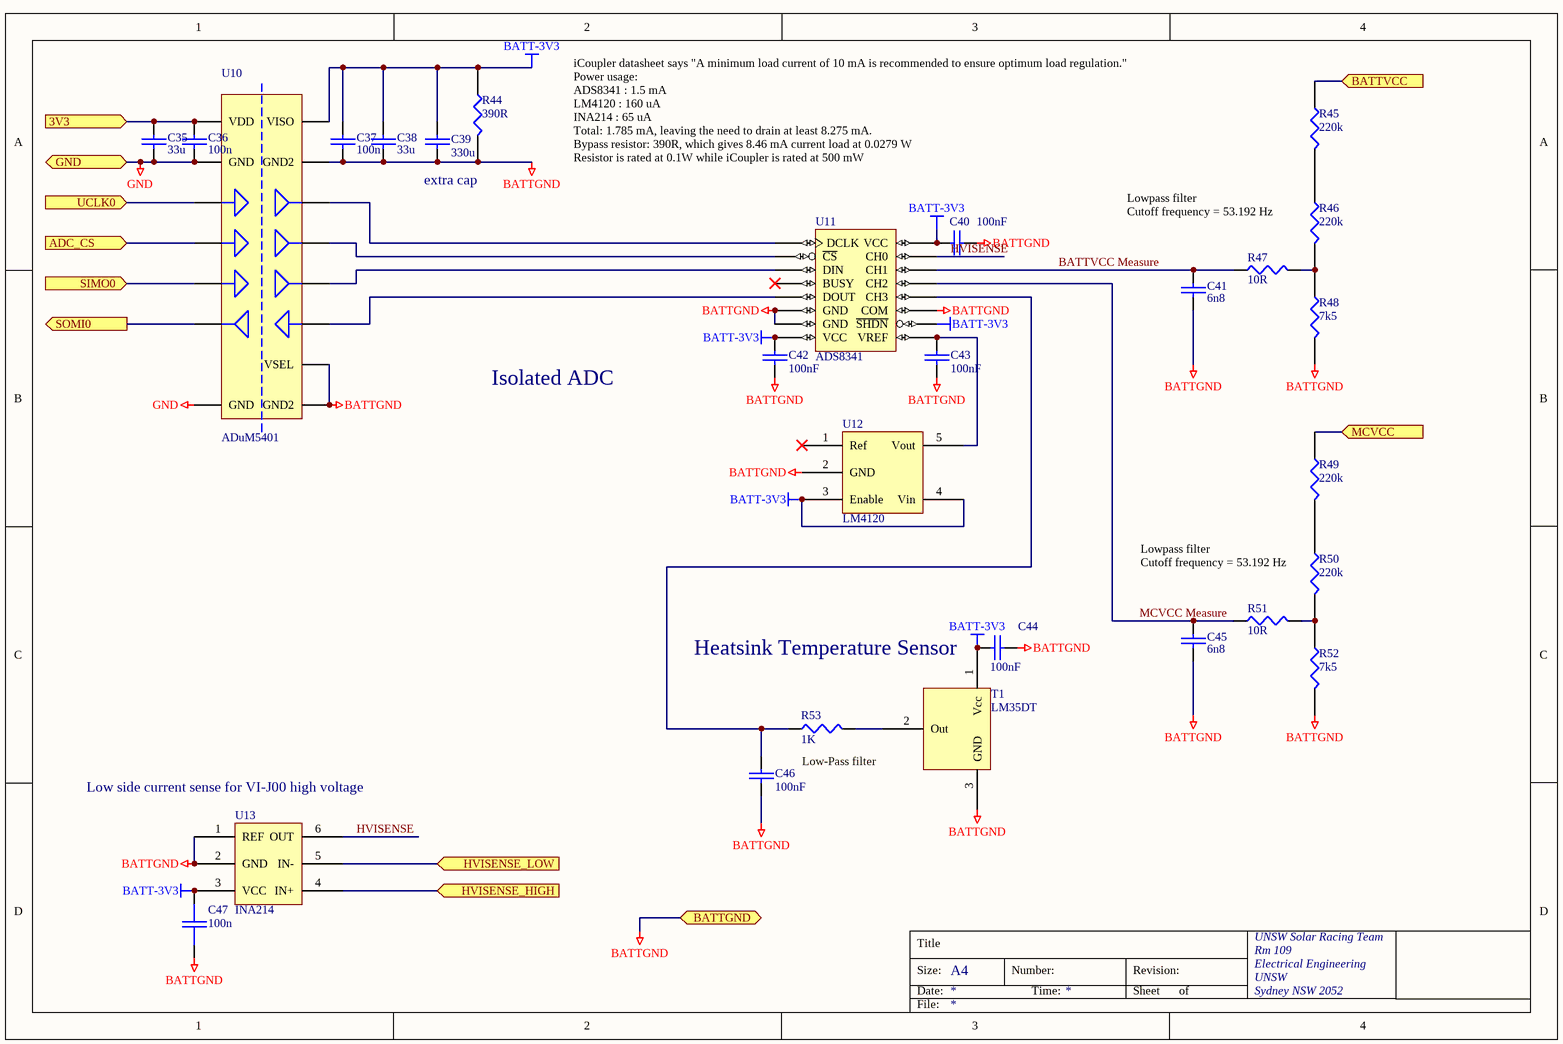
[diagram p8: IsolatedADC.SCHDOC]

### Parts
C35  33u  [MCCT-CASEB]
C36  100n  [0603]
C37  100n  [0603]
C38  33u  [MCCT-CASEB]
C39  330u  [KEMET_CASED]
C40  100nF  [0603]
C41  6n8  [0603]
C42  100nF  [0603]
C43  100nF  [0603]
C44  100nF  [0603]
C45  6n8  [0603]
C46  100nF  [0603]
C47  100n  [0603]
R44  390R  [0603]
R45  220k  [1206]
R46  220k  [1206]
R47  10R  [0603]
R48  7k5  [1206]
R49  220k  [1206]
R50  220k  [1206]
R51  10R  [0603]
R52  7k5  [1206]
R53  1K  [0603]
T1  LM35DT  [TO-220-up]
U10  ADuM5401  [SOIC_W16]
U11  ADS8341  [TSSOP16]
U12  LM4120  [SOT23-5]
U13  INA214  [SC70-6]

### Ports
3V3 (in), ADC_CS (in), BATTGND, BATTVCC (in), GND (bidir), HVISENSE_HIGH (in), HVISENSE_LOW (in), MCVCC (in), SIMO0 (in), SOMI0 (out), UCLK0 (in)

### Nets
3V3: C35.2 C36.2 U10.1(VDD) ; port 3V3
BATT-3V3: C37.2 C38.2 C39.1 C40.1 C42.2 C44.1 C47.2 R44.1 T1.1(Vcc) U10.16(VISO) U11.1(VCC) U11.7(~{SHDN}) U11.9(VCC) U12.3(Enable) U12.4(Vin) U13.3(VCC)
BATTGND: C37.1 C38.1 C39.2 C40.2 C41.2 C42.1 C43.2 C44.2 C45.2 C46.2 C47.1 R44.2 R48.2 R52.2 T1.3(GND) U10.9(GND2) U10.10(VSEL) U10.15(GND2) U11.6(COM) U11.10(GND) U11.11(GND) U12.2(GND) U13.1(REF) U13.2(GND) ; port BATTGND
BATTVCC: R45.1 ; port BATTVCC
GND: C35.1 C36.1 U10.2(GND) U10.8(GND) ; port GND
ADC_CS: U10.4(IN2) ; port ADC_CS
ADC_SIMO0: U10.5(IN3) ; port SIMO0
BATTVCC Measure: C41.1 R47.1 U11.3(CH1)
HVISENSE: U11.2(CH0) U13.6(OUT)
MCVCC: R49.1 ; port MCVCC
MCVCC Measure: C45.1 R51.1 U11.4(CH2)
P3.2: U10.6(OUT4) ; port SOMI0
P3.3: U10.3(IN1) ; port UCLK0
NetC22_1: U13.4(IN+) ; port HVISENSE_HIGH
NetC22_2: U13.5(IN-) ; port HVISENSE_LOW
NetC43_1: C43.1 U11.8(VREF) U12.5(Vout)
NetC46_1: C46.1 R53.1 U11.5(CH3)
NetR45_2: R45.2 R46.1
NetR46_2: R46.2 R47.2 R48.1
NetR49_2: R49.2 R50.1
NetR50_2: R50.2 R51.2 R52.1
NetR53_2: R53.2 T1.2(Out)
NetU10_11: U10.11(IN4) U11.12(DOUT)
NetU10_12: U10.12(OUT3) U11.14(DIN)
NetU10_13: U10.13(OUT2) U11.15(~{CS})
NetU10_14: U10.14(OUT1) U11.16(DCLK)

Not connected (* = marked no-connect by the designer): U11 13(BUSY)*; U12 1(Ref)*

### Notes on the sheet
- extra cap
- iCoupler datasheet says "A minimum load current of 10 mA is recommended to ensure optimum load regulation."
  Power usage:
  ADS8341 : 1.5 mA
  LM4120 : 160 uA
  INA214 : 65 uA
  Total: 1.785 mA, leaving the need to drain at least 8.275 mA.
  Bypass resistor: 390R, which gives 8.46 mA current load at 0.0279 W
  Resistor is rated at 0.1W while iCoupler is rated at 500 mW
- (near R46) Lowpass filter
  Cutoff frequency = 53.192 Hz
- Isolated ADC
- (near R50) Lowpass filter
  Cutoff frequency = 53.192 Hz
- (near C44) Heatsink Temperature Sensor
- (near U13) Low side current sense for VI-J00 high voltage
- Low-Pass filter
- Title
- Size:
- Date:
- A4
- Number:
- Time:
- Revision:
- Sheet
- of
- File:

### Library data of the parts
C35-C43 C45-C47 = CAP: Capacitor
  C35 C38: Farnell: 1135177; FarnellPrice: 0.64
  C39: Farnell: 1183405; FarnellPrice: 2.60; Digikey: 399-3884-1-ND; DigikeyPrice: 2.1
  C40 C42 C43 C46: Farnell: 753-567; Price: 0.31
  C41 C45: Farnell: 1642280
  C47: Price: 0.30
C44 = CAP: Capacitor; Order#: 753-567; Price: 0.31; Supplier: Farnell
R44-R46 R48-R50 R52 = RES1
  R44: Digikey: P390GCT-ND
  R45 R46 R49 R50: Farnell: 308-9587; Price: 1.16; Digikey: -
  R48 R52: Farnell: 308-6150; Price: 1.16
R47 R51 R53 = RES1: Resistor
  R47 R51: Farnell: ?
T1 = LM35DZ: Temperature Sensor; Farnell: 1469235; FarnellPrice: 5.13
U10 = ADuM5401: Optocoupler w/ DCDC; Digikey: ADUM5401ARWZ-ND
U12 = LM4120: Precision LDO voltage reference; Farnell: 9778802; FarnellPrice: 5.10; Digikey: LM4120AIM5-3.0CT-ND; DigikeyPrice: 2.95
U13 = INA214: Current Sensor; Farnell: 1606447
U11 = ADS8341: Farnell: 1212292; FarnellPrice: 27.40; Digikey: ADS8341E-ND; DigikeyPrice: 12.33

## Nets that join several sheets
3V3: TopLevel (R29.1 R30.1 R31.1 TP13.0), MSP430F149 (8 pins), 120-12V-DCDC (C13.2 U5.3 U7.1), 3V3-CAN (5 pins), 3V-Switcher-50mA (C5.1 L1.2 U3.1), CAN_Switch (R41.2), IsolatedADC (C35.2 C36.2 U10.1)
5V: TopLevel (R32.1 TP14.0), 12to5VSwitcher-3A (C12.1 L2.2 U4.1), CAN_Switch (Q5.3)
12V: TopLevel (R34.1), 120-12V-DCDC (R7.2 R8.1 TP7.0), 12to5VSwitcher-3A (5 pins), 3V-Switcher-50mA (7 pins), Precharge (D6.K F6.1 K1.1), CAN_Switch (Q5.1 R40.2)
BATTGND: 120-12V-DCDC (J4.1 R9.2 R10.1 TP8.0), Precharge (D10.A D11.K), IsolatedADC (24 pins)
BATTVCC: 120-12V-DCDC (6 pins), Precharge (D8.A), IsolatedADC (R45.1)
CAN+5V: TopLevel (R33.1), 3V3-CAN (D1.K F1.2 F3.2), CAN_Switch (Q5.5 Q5.6)
CAN+12V: TopLevel (R35.1), 3V3-CAN (D2.K F2.2 F4.2), CAN_Switch (Q5.7 Q5.8)
GND: TopLevel (5 pins), MSP430F149 (14 pins), 120-12V-DCDC (7 pins), 12to5VSwitcher-3A (7 pins), 3V3-CAN (10 pins), 3V-Switcher-50mA (5 pins), Precharge (8 pins), CAN_Switch (Q6.2 R43.1), IsolatedADC (C35.1 C36.1 U10.2 U10.8)
5V Measure: TopLevel (R32.2 R36.1), MSP430F149 (U8.5)
12V Measure: TopLevel (R34.2 R38.1), MSP430F149 (U8.6)
ADC0: MSP430F149 (U8.59), 120-12V-DCDC (U5.6)
ADC4: TopLevel (R33.2 R37.1), MSP430F149 (U8.3)
ADC5: TopLevel (R35.2 R39.1), MSP430F149 (U8.4)
ADC_CS: MSP430F149 (U8.32), IsolatedADC (U10.4)
ADC_SIMO0: MSP430F149 (U8.29), IsolatedADC (U10.5)
CAN_SW: MSP430F149 (U8.36), CAN_Switch (R42.1)
CONTACT_SW: MSP430F149 (U8.35), Precharge (R24.1)
CONTACT_Vref: MSP430F149 (U8.34), Precharge (D14.K R21.1 R23.1)
DCDC_SW: MSP430F149 (U8.33), 120-12V-DCDC (R12.1)
LEDRED: TopLevel (D16.3), MSP430F149 (U8.50)
LEDYLW: TopLevel (D16.2), MSP430F149 (U8.51)
MCVCC: Precharge (J6.1 R17.2 TP11.0), IsolatedADC (R49.1)
NetC22_1: 120-12V-DCDC (C22.1 R11.2), IsolatedADC (U13.4)
NetC22_2: 120-12V-DCDC (C22.2 R10.2), IsolatedADC (U13.5)
P1.0: MSP430F149 (U8.12), 3V3-CAN (U2.19)
P1.4: MSP430F149 (U8.16), 3V3-CAN (U2.13)
P1.5: MSP430F149 (U8.17), Precharge (R15.2)
P3.2: MSP430F149 (U8.30), IsolatedADC (U10.6)
P3.3: MSP430F149 (U8.31), IsolatedADC (U10.3)
P5.0: MSP430F149 (U8.44), 3V3-CAN (R1.1 U2.18)
P5.1: MSP430F149 (U8.45), 3V3-CAN (U2.16)
P5.2: MSP430F149 (U8.46), 3V3-CAN (U2.17)
P5.3: MSP430F149 (U8.47), 3V3-CAN (U2.14)